# EAGLE design encoder_resolver (EAGLE 6.5.0)

## Sheet 1 of 8
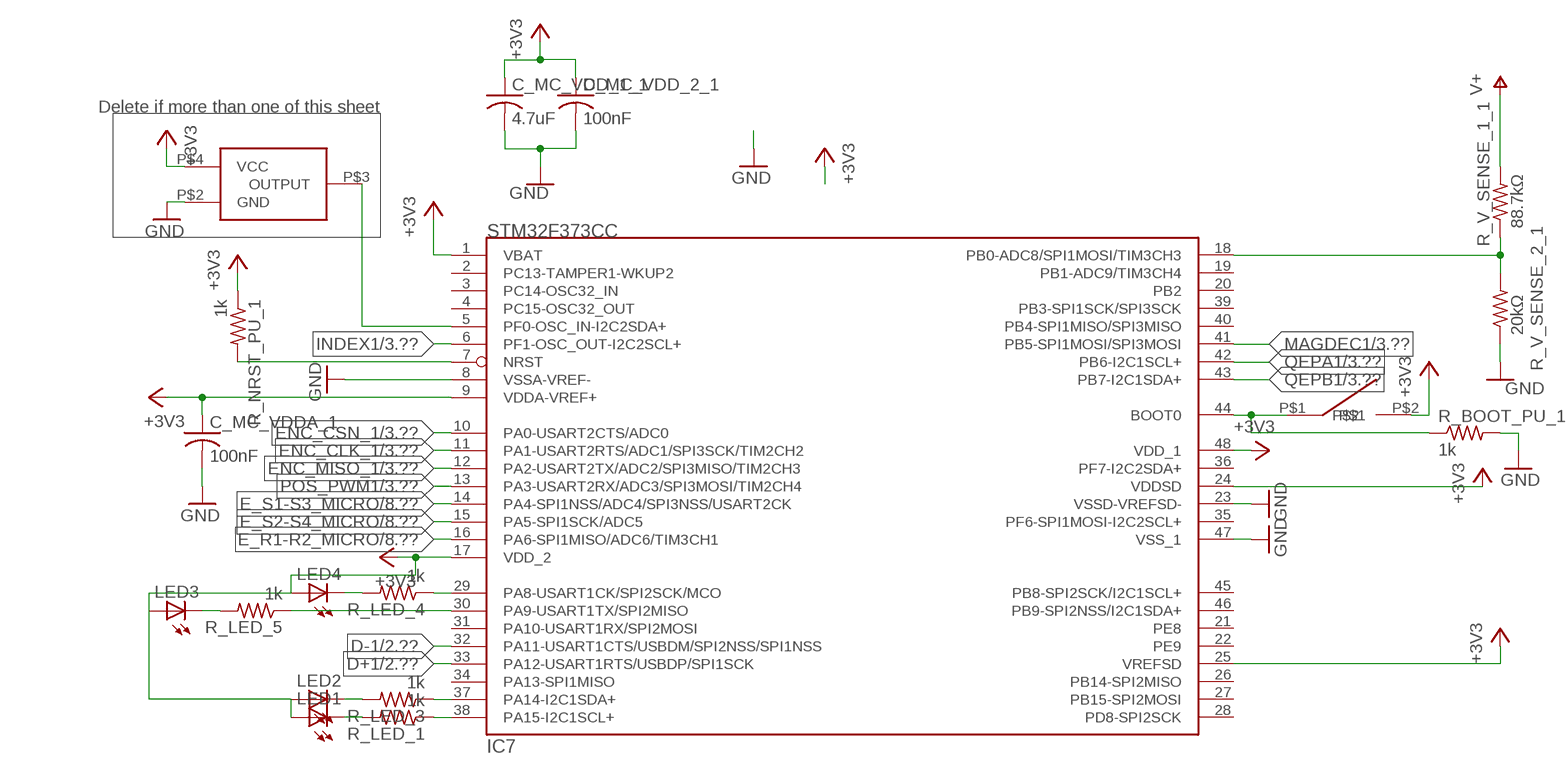
[diagram p0: schematic, sheet 1]

### Parts
C_MC_VDD_1_1  4.7uF  C-USC0603  [C0603]
C_MC_VDD_2_1  100nF  C-USC0603  [C0603]
C_MC_VDDA_1  100nF  C-USC0603  [C0603]
IC7  STM32F373CC  [LQFP48]
LED1  LEDCHIPLED_0603  [CHIPLED_0603]
LED2  LEDCHIPLED_0603  [CHIPLED_0603]
LED3  LEDCHIPLED_0603  [CHIPLED_0603]
LED4  LEDCHIPLED_0603  [CHIPLED_0603]
OSC1  FOX924B  [4-SMD_5X3.2]
R_BOOT_PU_1  1k  R-US_R0603  [R0603]
R_LED_1  1k  R-US_R0603  [R0603]
R_LED_3  1k  R-US_R0603  [R0603]
R_LED_4  1k  R-US_R0603  [R0603]
R_LED_5  1k  R-US_R0603  [R0603]
R_NRST_PU_1  1k  R-US_R0603  [R0603]
R_V_SENSE_1_1  88.7kΩ  R-US_R0603  [R0603]
R_V_SENSE_2_1  20kΩ  R-US_R0603  [R0603]
SW1  B3U  [B3U]

### Nets
16MHZ_3V3: IC7.5(PF0-OSC_IN-I2C2SDA+) OSC1.P$3(OUTPUT)
+3V3: C_MC_VDD_1_1.1 C_MC_VDD_2_1.1 C_MC_VDDA_1.1 IC7.1(VBAT) IC7.9(VDDA-VREF+) IC7.17(VDD_2) IC7.24(VDDSD) IC7.25(VREFSD) IC7.48(VDD_1) LED1.A LED2.A LED3.A LED4.A OSC1.P$4(VCC) R_NRST_PU_1.1 SW1.P$2 ; also sheet 3,5,8
BOOT0_1: IC7.44(BOOT0) R_BOOT_PU_1.1 SW1.P$1
D+1: IC7.33(PA12-USART1RTS/USBDP/SPI1SCK) ; also sheet 2
D-1: IC7.32(PA11-USART1CTS/USBDM/SPI2NSS/SPI1NSS) ; also sheet 2
E_R1-R2_MICRO: IC7.16(PA6-SPI1MISO/ADC6/TIM3CH1) ; also sheet 8
E_S1-S3_MICRO: IC7.14(PA4-SPI1NSS/ADC4/SPI3NSS/USART2CK) ; also sheet 8
E_S2-S4_MICRO: IC7.15(PA5-SPI1SCK/ADC5) ; also sheet 8
ENC_CLK_1: IC7.11(PA1-USART2RTS/ADC1/SPI3SCK/TIM2CH2) ; also sheet 3
ENC_CSN_1: IC7.10(PA0-USART2CTS/ADC0) ; also sheet 3
ENC_MISO_1: IC7.12(PA2-USART2TX/ADC2/SPI3MISO/TIM2CH3) ; also sheet 3
GND: C_MC_VDD_1_1.2 C_MC_VDD_2_1.2 C_MC_VDDA_1.2 IC7.8(VSSA-VREF-) IC7.23(VSSD-VREFSD-) IC7.47(VSS_1) OSC1.P$2(GND) R_BOOT_PU_1.2 R_V_SENSE_2_1.1 ; also sheet 2,3,4,5,6,7,8
INDEX1: IC7.6(PF1-OSC_OUT-I2C2SCL+) ; also sheet 3
MAGDEC1: IC7.41(PB5-SPI1MOSI/SPI3MOSI) ; also sheet 3
N$1: LED1.C R_LED_1.2
N$3: IC7.18(PB0-ADC8/SPI1MOSI/TIM3CH3) R_V_SENSE_1_1.1 R_V_SENSE_2_1.2
N$5: IC7.38(PA15-I2C1SCL+) R_LED_1.1
N$6: LED2.C R_LED_3.2
N$8: IC7.37(PA14-I2C1SDA+) R_LED_3.1
N$10: LED4.C R_LED_4.2
N$11: LED3.C R_LED_5.2
N$12: IC7.29(PA8-USART1CK/SPI2SCK/MCO) R_LED_4.1
N$13: IC7.30(PA9-USART1TX/SPI2MISO) R_LED_5.1
NRST_1: IC7.7(NRST) R_NRST_PU_1.2
POS_PWM1: IC7.13(PA3-USART2RX/ADC3/SPI3MOSI/TIM2CH4) ; also sheet 3
QEPA1: IC7.42(PB6-I2C1SCL+) ; also sheet 3
QEPB1: IC7.43(PB7-I2C1SDA+) ; also sheet 3
V+: R_V_SENSE_1_1.2 ; also sheet 4,7,8
Unconnected: IC7.2(PC13-TAMPER1-WKUP2) IC7.3(PC14-OSC32_IN) IC7.4(PC15-OSC32_OUT) IC7.19(PB1-ADC9/TIM3CH4) IC7.20(PB2) IC7.21(PE8) IC7.22(PE9) IC7.26(PB14-SPI2MISO) IC7.27(PB15-SPI2MOSI) IC7.28(PD8-SPI2SCK) IC7.31(PA10-USART1RX/SPI2MOSI) IC7.34(PA13-SPI1MISO) IC7.35(PF6-SPI1MOSI-I2C2SCL+) IC7.36(PF7-I2C2SDA+) IC7.39(PB3-SPI1SCK/SPI3SCK) IC7.40(PB4-SPI1MISO/SPI3MISO) IC7.45(PB8-SPI2SCK/I2C1SCL+) IC7.46(PB9-SPI2NSS/I2C1SDA+)

### Notes on the sheet
- Delete if more than one of this sheet

## Sheet 2 of 8
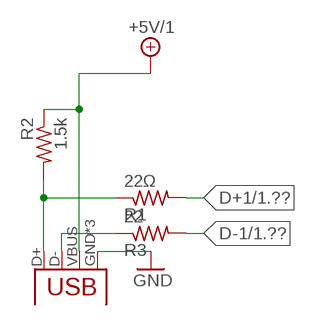
[diagram p1: schematic, sheet 2]

### Parts
R1  22Ω  R-US_R0603  [R0603]
R2  1.5k  R-US_R0603  [R0603]
R3  22  R-US_R0603  [R0603]
X1  USB-MICROB  [USB-MICROB]

### Nets
+5V/1: R2.1 X1.VBUS ; also sheet 6
D+1: R1.2 ; also sheet 1
D+_IN_1: R1.1 R2.2 X1.D+
D-1: R3.2 ; also sheet 1
D-_IN_1: R3.1 X1.D-
GND: X1.GND X1.MT1(GND) X1.MT2(GND) ; also sheet 1,3,4,5,6,7,8

## Sheet 3 of 8
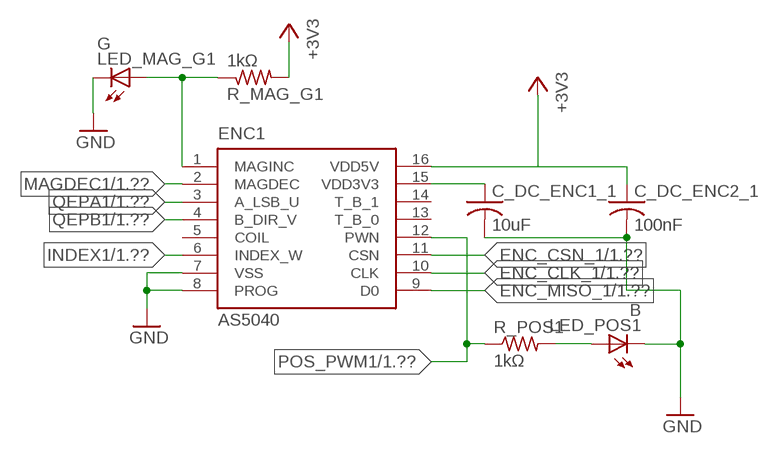
[diagram p2: schematic, sheet 3]

### Parts
C_DC_ENC1_1  10uF  C-USC0603  [C0603]
C_DC_ENC2_1  100nF  C-USC0603  [C0603]
ENC1  AS5040  [SSOP16]
LED_MAG_G1  G  LEDCHIP-LED0603  [CHIP-LED0603]
LED_POS1  B  LEDCHIP-LED0603  [CHIP-LED0603]
R_MAG_G1  1kΩ  R-US_R0603  [R0603]
R_POS1  1kΩ  R-US_R0603  [R0603]

### Nets
+3V3: C_DC_ENC2_1.1 ENC1.16(VDD5V) R_MAG_G1.2 ; also sheet 1,5,8
ENC_3V3_1: C_DC_ENC1_1.1 ENC1.15(VDD3V3)
ENC_CLK_1: ENC1.10(CLK) ; also sheet 1
ENC_CSN_1: ENC1.11(CSN) ; also sheet 1
ENC_MISO_1: ENC1.9(D0) ; also sheet 1
GND: C_DC_ENC1_1.2 C_DC_ENC2_1.2 ENC1.7(VSS) ENC1.8(PROG) LED_MAG_G1.C LED_POS1.C ; also sheet 1,2,4,5,6,7,8
INDEX1: ENC1.6(INDEX_W) ; also sheet 1
MAGDEC1: ENC1.2(MAGDEC) ; also sheet 1
MAGINC1: ENC1.1(MAGINC) LED_MAG_G1.A R_MAG_G1.1
N$15: LED_POS1.A R_POS1.2
POS_PWM1: ENC1.12(PWN) R_POS1.1 ; also sheet 1
QEPA1: ENC1.3(A_LSB_U) ; also sheet 1
QEPB1: ENC1.4(B_DIR_V) ; also sheet 1
Unconnected: ENC1.5(COIL) ENC1.13(T_B_0) ENC1.14(T_B_1)

## Sheet 4 of 8
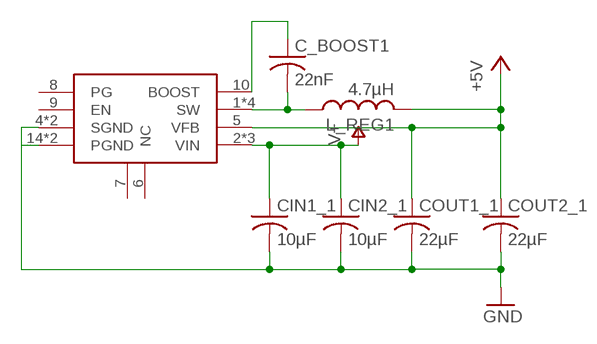
[diagram p3: schematic, sheet 4]

### Parts
C_BOOST1  22nF  C-USC0603  [C0603]
CIN1_1  10µF  C-USC0805  [C0805]
CIN2_1  10µF  C-USC0805  [C0805]
COUT1_1  22µF  C-USC0603  [C0603]
COUT2_1  22µF  C-USC0603  [C0603]
L_REG1  4.7µH  VLC5045  [VLC5045]
SW_REG1  MCP16323  [QFN16]

### Nets
+5V: COUT1_1.1 COUT2_1.1 L_REG1.2 SW_REG1.5(VFB) ; also sheet 5,6
BOOST1: C_BOOST1.1 SW_REG1.10(BOOST)
GND: CIN1_1.2 CIN2_1.2 COUT1_1.2 COUT2_1.2 SW_REG1.4(SGND) SW_REG1.14(PGND) SW_REG1.15(PGND) SW_REG1.TH(SGND) ; also sheet 1,2,3,5,6,7,8
SW1: C_BOOST1.2 L_REG1.1 SW_REG1.1(SW) SW_REG1.12(SW) SW_REG1.13(SW) SW_REG1.16(SW)
V+: CIN1_1.1 CIN2_1.1 SW_REG1.2(VIN) SW_REG1.3(VIN) SW_REG1.11(VIN) ; also sheet 1,7,8
Unconnected: SW_REG1.6(NC) SW_REG1.7(NC2) SW_REG1.8(PG) SW_REG1.9(EN)

## Sheet 5 of 8
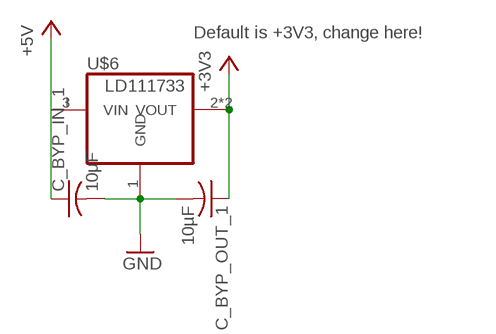
[diagram p4: schematic, sheet 5]

### Parts
C_BYP_IN_1  10µF  C-USC1206  [C1206]
C_BYP_OUT_1  10µF  C-USC0603  [C0603]
U$6  LD111733  REG_SOT223LD1117XX  [SOT-223]

### Nets
+3V3: C_BYP_OUT_1.1 U$6.2(VOUT) U$6.4(VOUT) ; also sheet 1,3,8
+5V: C_BYP_IN_1.1 U$6.3(VIN) ; also sheet 4,6
GND: C_BYP_IN_1.2 C_BYP_OUT_1.2 U$6.1(GND) ; also sheet 1,2,3,4,6,7,8

### Notes on the sheet
- Default is +3V3, change here!

## Sheet 6 of 8
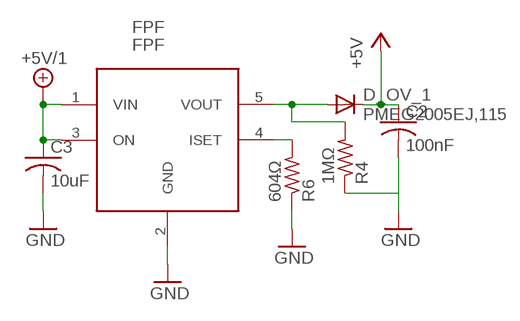
[diagram p5: schematic, sheet 6]

### Parts
C2  100nF  C-USC0603  [C0603]
C3  10uF  C-USC0603  [C0603]
D_OV_1  PMEG2005EJ,115  DIODE-SOD323-W  [SOD323-W]
FPF  FPF  FPF2123  [SOT23-5L]
R4  1MΩ  R-US_R0603  [R0603]
R6  604Ω  R-US_R0603  [R0603]

### Nets
+5V: C2.1 D_OV_1.C ; also sheet 4,5
+5V/1: C3.1 FPF.1(VIN) FPF.3(ON) ; also sheet 2
GND: C2.2 C3.2 FPF.2(GND) R4.1 R6.1 ; also sheet 1,2,3,4,5,7,8
LOAD_ISET_1: FPF.4(ISET) R6.2
N$17: D_OV_1.A FPF.5(VOUT) R4.2

## Sheet 7 of 8
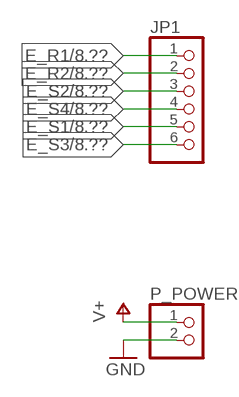
[diagram p6: schematic, sheet 7]

### Parts
JP1  PINHD-1X6  [1X06]
P_POWER  PINHD-1X2  [1X02]

### Nets
E_R1: JP1.1 ; also sheet 8
E_R2: JP1.2 ; also sheet 8
E_S1: JP1.5 ; also sheet 8
E_S2: JP1.3 ; also sheet 8
E_S3: JP1.6 ; also sheet 8
E_S4: JP1.4 ; also sheet 8
GND: P_POWER.2 ; also sheet 1,2,3,4,5,6,8
V+: P_POWER.1 ; also sheet 1,4,8

## Sheet 8 of 8
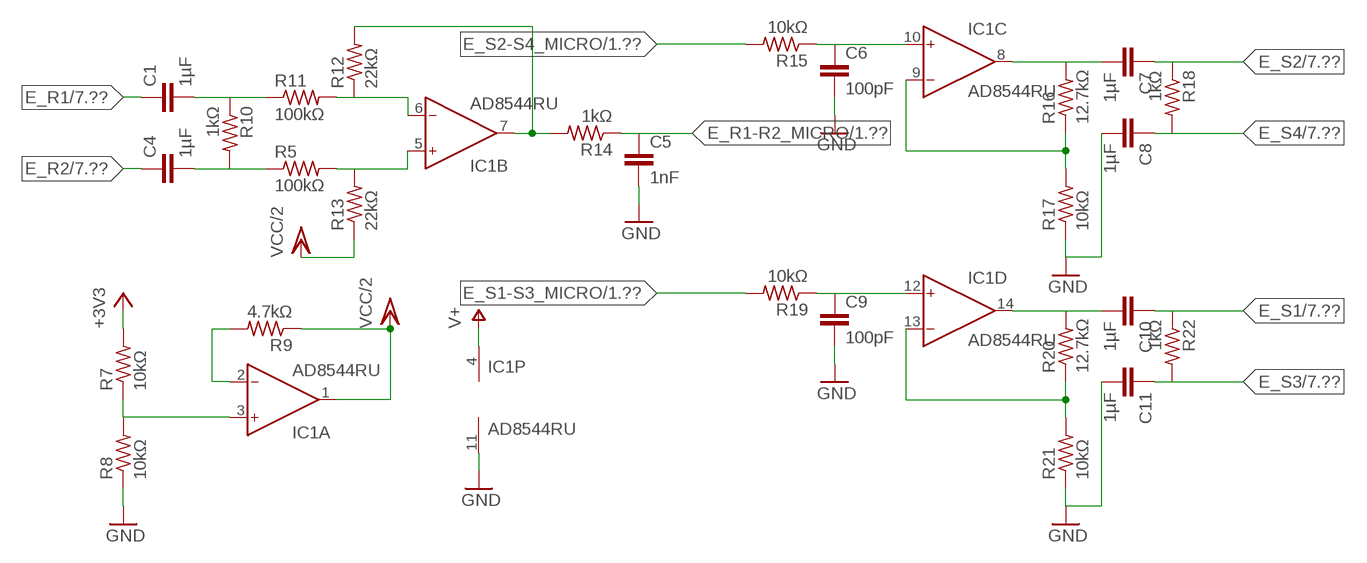
[diagram p7: schematic, sheet 8]

### Parts
C1  1µF  C-EUC0603  [C0603]
C4  1µF  C-EUC0603  [C0603]
C5  1nF  C-EUC0603  [C0603]
C6  100pF  C-EUC0603  [C0603]
C7  1µF  C-EUC0603  [C0603]
C8  1µF  C-EUC0603  [C0603]
C9  100pF  C-EUC0603  [C0603]
C10  1µF  C-EUC0603  [C0603]
C11  1µF  C-EUC0603  [C0603]
IC1  AD8544RU  [TSSOP14]
R5  100kΩ  R-US_R0603  [R0603]
R7  10kΩ  R-US_R0603  [R0603]
R8  10kΩ  R-US_R0603  [R0603]
R9  4.7kΩ  R-US_R0603  [R0603]
R10  1kΩ  R-US_R0603  [R0603]
R11  100kΩ  R-US_R0603  [R0603]
R12  22kΩ  R-US_R0603  [R0603]
R13  22kΩ  R-US_R0603  [R0603]
R14  1kΩ  R-US_R0603  [R0603]
R15  10kΩ  R-US_R0603  [R0603]
R16  12.7kΩ  R-US_R0603  [R0603]
R17  10kΩ  R-US_R0603  [R0603]
R18  1kΩ  R-US_R0603  [R0603]
R19  10kΩ  R-US_R0603  [R0603]
R20  12.7kΩ  R-US_R0603  [R0603]
R21  10kΩ  R-US_R0603  [R0603]
R22  1kΩ  R-US_R0603  [R0603]

### Nets
+3V3: R7.2 ; also sheet 1,3,5
E_R1: C1.1 ; also sheet 7
E_R1-R2_MICRO: C5.1 R14.1 ; also sheet 1
E_R2: C4.1 ; also sheet 7
E_S1: C10.1 R22.1 ; also sheet 7
E_S1-S3_MICRO: R19.2 ; also sheet 1
E_S2: C7.1 R18.1 ; also sheet 7
E_S2-S4_MICRO: R15.2 ; also sheet 1
E_S3: C11.1 R22.2 ; also sheet 7
E_S4: C8.1 R18.2 ; also sheet 7
GND: C5.2 C6.2 C8.2 C9.2 C11.2 IC1.11(P:V-) R8.1 R17.1 R21.1 ; also sheet 1,2,3,4,5,6,7
N$2: IC1.3(A:IN+) R7.1 R8.2
N$9: IC1.2(A:IN-) R9.2
N$18: C4.2 R5.1 R10.2
N$19: C1.2 R10.1 R11.1
N$20: IC1.5(B:IN+) R5.2 R13.2
N$21: IC1.6(B:IN-) R11.2 R12.1
N$22: IC1.7(B:OUT) R12.2 R14.2
N$23: C6.1 IC1.10(C:IN+) R15.1
N$24: IC1.9(C:IN-) R16.1 R17.2
N$25: C7.2 IC1.8(C:OUT) R16.2
N$26: C9.1 IC1.12(D:IN+) R19.1
N$27: IC1.13(D:IN-) R20.1 R21.2
N$28: C10.2 IC1.14(D:OUT) R20.2
V+: IC1.4(P:V+) ; also sheet 1,4,7
VCC/2: IC1.1(A:OUT) R9.1 R13.1

## Library data of the parts
C1 C4-C11 = resistor:C-EU: CAPACITOR, European symbol
C2 C3 C_BOOST1 C_BYP_IN_1 C_BYP_OUT_1 C_DC_ENC1_1 C_DC_ENC2_1 C_MC_VDD_1_1 C_MC_VDD_2_1 C_MC_VDDA_1 CIN1_1 CIN2_1 COUT1_1 COUT2_1 = resistor:C-US: CAPACITOR, American symbol
D_OV_1 = diode:DIODE-: DIODE
ENC1 = austriamicrosystems:AS5040: 10-BIT PROGRAMMABLE MAGNETIC ROTARY ENCODER Source: www.austriamicrosystems.com .. AS5040DataSheetRev12.pdf; MPN: AS5040ASSU; OC_FARNELL: 1630800; OC_NEWARK: 59P4059
FPF = neels:FPF2123
IC1 = analog-devices:AD8544: General-Purpose CMOS Rail-to-Rail Amplifiers Source: http://www.analog.com/static/imported-files/data_sheets/AD8541_8542_8544.pdf; MPN: AD8544ARUZ; OC_FARNELL: unknown; OC_NEWARK: 15P1001
IC7 = neels:STM32F373CC
JP1 = pinhead:PINHD-1X6: PIN HEADER
L_REG1 = piccoli:VLC5045
LED1-LED4 LED_MAG_G1 LED_POS1 = led:LED: LED OSRAM: - CHIPLED LG R971, LG N971, LY N971, LG Q971, LY Q971, LO R971, LY R971 LH N974, LH R974 LS Q976, LO Q976, LY Q976 LO Q996 - Hyper CHIPLED LW Q18S LB Q993, LB Q99A, LB R99A - SideLED LS A670, LO A670, LY A670, LG A670, LP A670 LB A673, LV A673, LT A673, LW A673 LH A674 LY A675 LS A676, LA A676, LO A676, LY A676, LW A676 LS A679, LY A679, LG A679 - Hyper Micro SIDELED® LS Y876, LA Y876, LO Y876, LY Y876 LT Y87S - SmartLED LW L88C, LW L88S LB L89C, LB L89S, LG L890 LS L89K, LO L89K, LY L89K LS L896, LA L896, LO L896, LY L896 - TOPLED LS T670, LO T670, LY T670, LG T670, LP T670 LSG T670, LSP T670, LSY T670, LOP T670, LYG T670 LG T671, LOG T671, LSG T671 LB T673, LV T673, LT T673, LW T673 LH T674 LS T676, LA T676, LO T676, LY T676, LB T676, LH T676, LSB T676, LW T676 LB T67C, LV T67C, LT T67C, LS T67K, LO T67K, LY T67K, LW E67C LS E67B, LA E67B, LO E67B, LY E67B, LB E67C, LV E67C, LT E67C LW T67C LS T679, LY T679, LG T679 LS T770, LO T770, LY T770, LG T770, LP T770 LB T773, LV T773, LT T773, LW T773 LH T774 LS E675, LA E675, LY E675, LS T675 LS T776, LA T776, LO T776, LY T776, LB T776 LHGB T686 LT T68C, LB T68C - Hyper Mini TOPLED® LB M676 - Mini TOPLED Santana® LG M470 LS M47K, LO M47K, LY M47K Source: http://www.osram.convergy.de LUXEON: - LUMILED® LXK2-PW12-R00, LXK2-PW12-S00, LXK2-PW14-U00, LXK2-PW14-V00 LXK2-PM12-R00, LXK2-PM12-S00, LXK2-PM14-U00 LXK2-PE12-Q00, LXK2-PE12-R00, LXK2-PE12-S00, LXK2-PE14-T00, LXK2-PE14-U00 LXK2-PB12-K00, LXK2-PB12-L00, LXK2-PB12-M00, LXK2-PB14-N00, LXK2-PB14-P00, LXK2-PB14-Q00 LXK2-PR12-L00, LXK2-PR12-M00, LXK2-PR14-Q00, LXK2-PR14-R00 LXK2-PD12-Q00, LXK2-PD12-R00, LXK2-PD12-S00 LXK2-PH12-R00, LXK2-PH12-S00 LXK2-PL12-P00, LXK2-PL12-Q00, LXK2-PL12-R00 Source: www.luxeon.com KINGBRIGHT: KA-3528ASYC Source: www.kingbright.com
OSC1 = piccoli:FOX924B
P_POWER = pinhead:PINHD-1X2: PIN HEADER
R1-R22 R_BOOT_PU_1 R_LED_1 R_LED_3-R_LED_5 R_MAG_G1 R_NRST_PU_1 R_POS1 R_V_SENSE_1_1 R_V_SENSE_2_1 = resistor:R-US_: RESISTOR, American symbol
SW1 = zz-upenn:B3U
SW_REG1 = piccoli:MCP16323
U$6 = piccoli:REG_SOT223
X1 = SparkFun:USB: USB Connectors USB-B-PTH is fully proven SKU : PRT-00139 USB-miniB is fully proven SKU : PRT-00587 USB-A-PCB is untested. USB-A-H is throughly reviewed, but untested. Spark Fun Electronics SKU : PRT-00437 USB-B-SMT is throughly reviewed, but untested. Needs silkscreen touching up. USB-A-S has not been used/tested USB-MB-H has not been used/tested

## Board
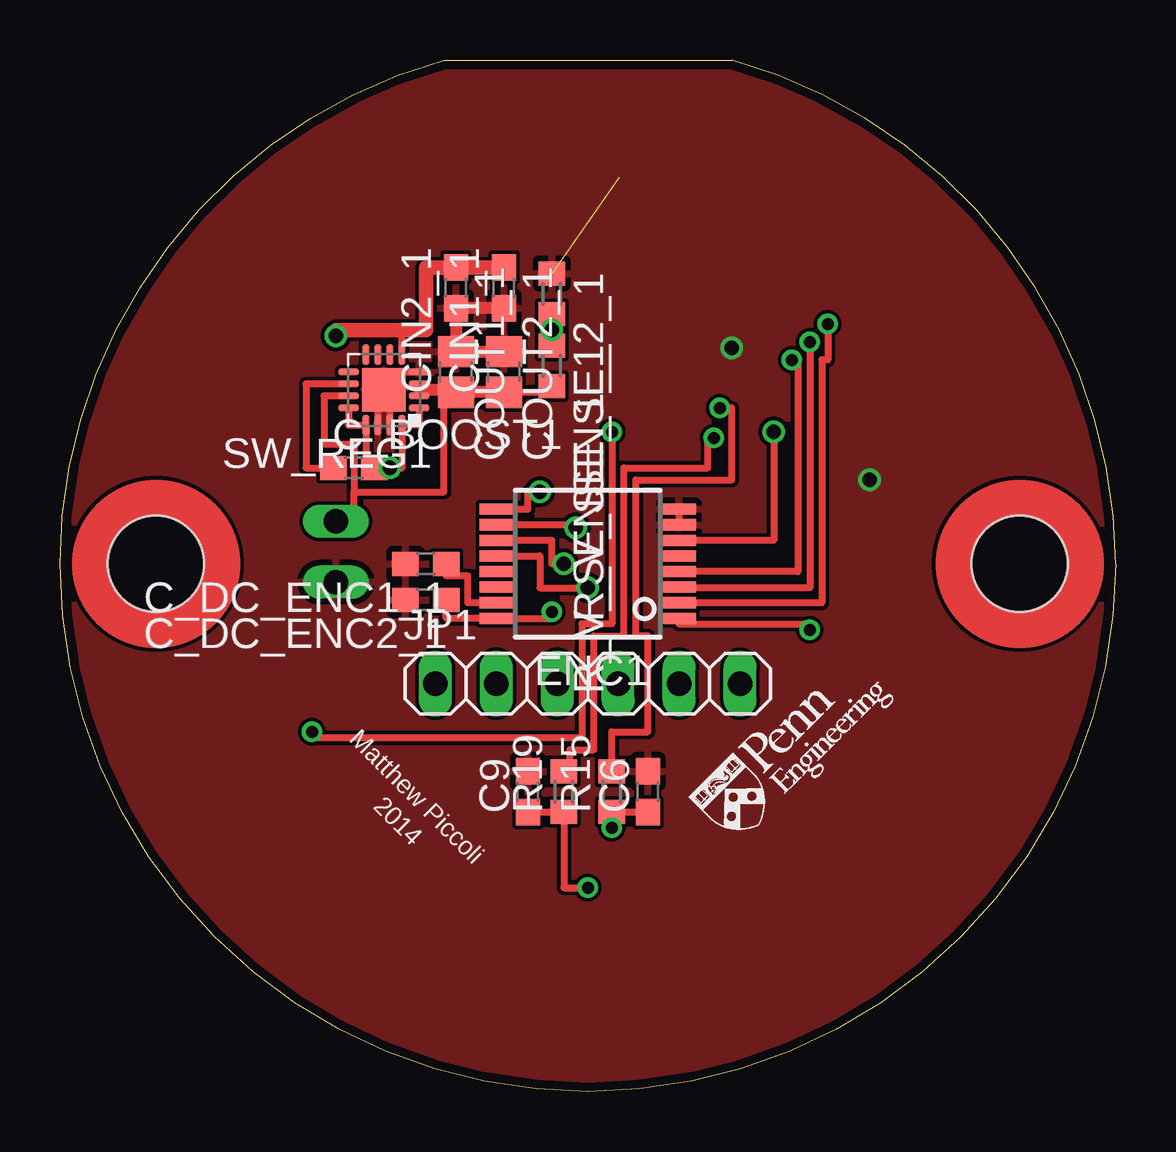
[diagram p8: board, top side]
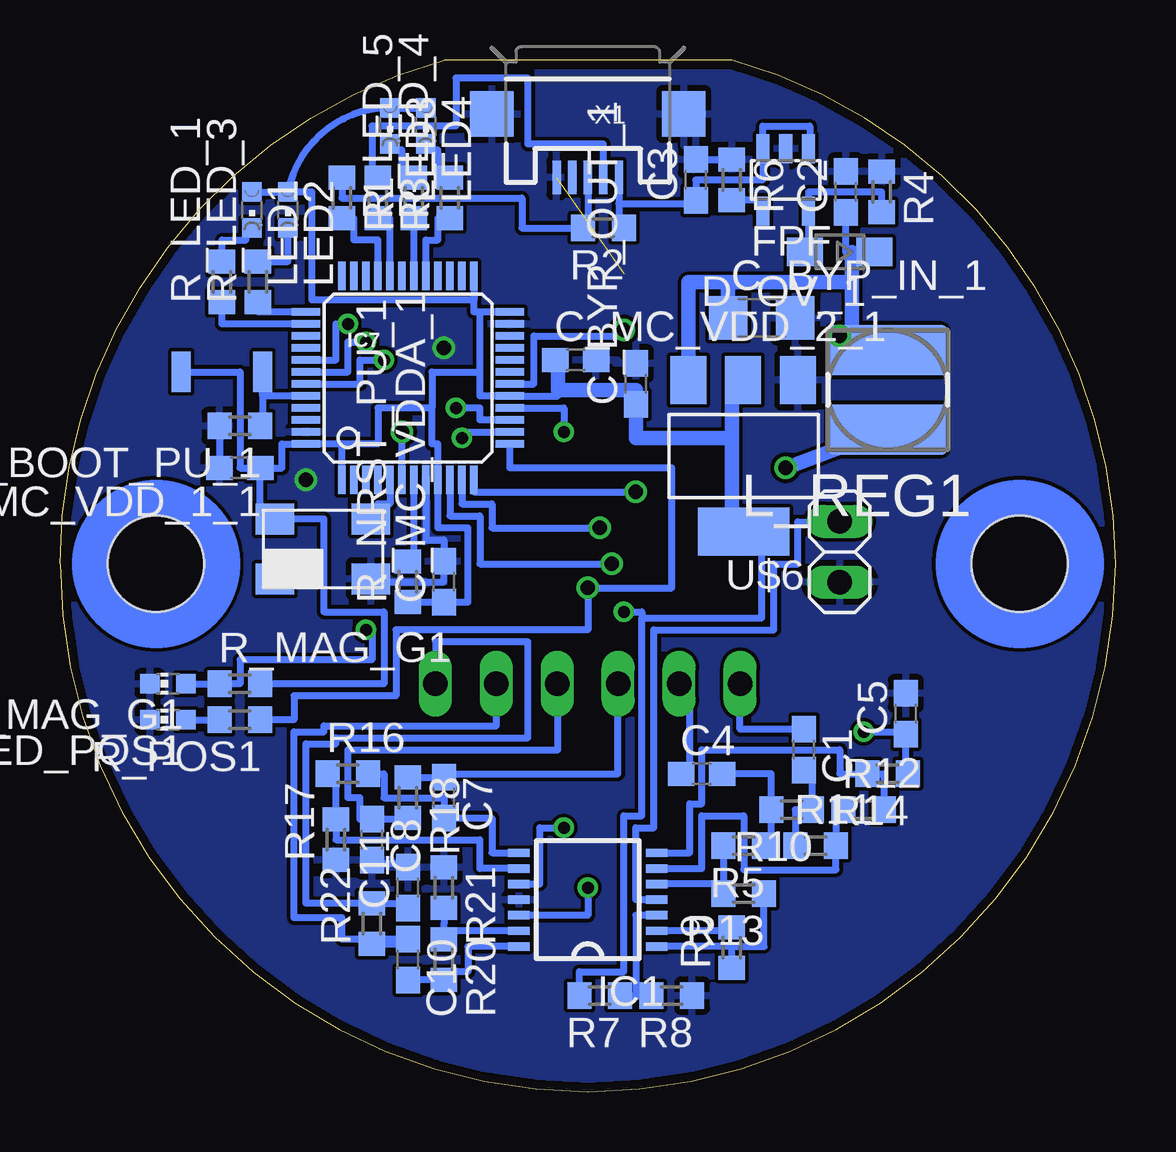
[diagram p9: board, bottom side, seen from below]

Size 44 x 43 mm. Coordinates in mm from the lower left corner, seen from the top.
Outline: 44,22 arc-180 0,22
Outline: 44,22 arc-180 0,22
Outline: 0,22 arc-74 16,43 28,43 arc-74 44,22
Copper layers (1*16): Top 0.0356mm / dielectric 1.5011mm / Bottom 0.0356mm
Design rules "LaenPCBOrder *": minimum track width 6mil, minimum drill 13mil, track to track 6mil, track to pad 6mil, pad to pad 6mil, via to via 6mil, smd to smd 6mil, copper to edge 15mil, drill to drill 6mil, minimum pad ring 7mil, minimum via ring 7mil, stop-mask expansion 4mil, vias tented up to drill 0mil, thermal gap 10mil
Holes 4 mm at 4,22 40,22

### Footprints (pad centres in the part's own frame; a part is rotated, then mirrored left to right if it is on the bottom)
C0603 = smd 1.1 x 1: 1 -0.85,0; 2 0.85,0
C1206 = smd 1.6 x 1.8: 1 -1.4,0; 2 1.4,0
C0805 = smd 1.3 x 1.5: 1 -0.85,0; 2 0.85,0
SOD323-W = smd 1.5 x 1.2: A 1.45,0; C -1.45,0
SSOP16 = smd 0.46 x 1.43: 1 -2.275,-3.795; 2 -1.625,-3.795; 3 -0.975,-3.795; 4 -0.325,-3.795; 5 0.325,-3.795; 6 0.975,-3.795; 7 1.625,-3.795; 8 2.275,-3.795; 9 2.275,3.795; 10 1.625,3.795; 11 0.975,3.795; 12 0.325,3.795; 13 -0.325,3.795; 14 -0.975,3.795; 15 -1.625,3.795; 16 -2.275,3.795
SOT23-5L = smd 0.55 x 1.2: 1 -0.95,-1.3; 2 0,-1.3; 3 0.95,-1.3; 4 0.95,1.3; 5 -0.95,1.3
TSSOP14 = smd 0.9 x 0.35: 1 -2.875,1.95; 2 -2.875,1.3; 3 -2.875,0.65; 4 -2.875,0; 5 -2.875,-0.65; 6 -2.875,-1.3; 7 -2.875,-1.95; 8 2.875,-1.95; 9 2.875,-1.3; 10 2.875,-0.65; 11 2.875,0; 12 2.875,0.65; 13 2.875,1.3; 14 2.875,1.95
LQFP48 = smd 0.3 x 1.2: 1 -2.75,-4.25; 2 -2.25,-4.25; 3 -1.75,-4.25; 4 -1.25,-4.25; 5 -0.75,-4.25; 6 -0.25,-4.25; 7 0.25,-4.25; 8 0.75,-4.25; 9 1.25,-4.25; 10 1.75,-4.25; 11 2.25,-4.25; 12 2.75,-4.25; 25 2.75,4.25; 26 2.25,4.25; 27 1.75,4.25; 28 1.25,4.25; 29 0.75,4.25; 30 0.25,4.25; 31 -0.25,4.25; 32 -0.75,4.25; 33 -1.25,4.25; 34 -1.75,4.25; 35 -2.25,4.25; 36 -2.75,4.25 | smd 1.2 x 0.3: 13 4.25,-2.75; 14 4.25,-2.25; 15 4.25,-1.75; 16 4.25,-1.25; 17 4.25,-0.75; 18 4.25,-0.25; 19 4.25,0.25; 20 4.25,0.75; 21 4.25,1.25; 22 4.25,1.75; 23 4.25,2.25; 24 4.25,2.75; 37 -4.25,2.75; 38 -4.25,2.25; 39 -4.25,1.75; 40 -4.25,1.25; 41 -4.25,0.75; 42 -4.25,0.25; 43 -4.25,-0.25; 44 -4.25,-0.75; 45 -4.25,-1.25; 46 -4.25,-1.75; 47 -4.25,-2.25; 48 -4.25,-2.75
1X06 = drill 1.016 long: 1 -6.35,0; 2 -3.81,0; 3 -1.27,0; 4 1.27,0; 5 3.81,0; 6 6.35,0
VLC5045 = smd 5 x 2.1: 1 0,1.65; 2 0,-1.65
CHIPLED_0603 = smd 0.8 x 0.8: A 0,-0.75; C 0,0.75
CHIP-LED0603 = smd 0.8 x 0.8: A 0,-0.75; C 0,0.75
4-SMD_5X3.2 = smd 1.6 x 1.3: P$1 -2,-1.25; P$2 2,-1.25; P$3 2,1.25; P$4 -2,1.25
1X02 = drill 1.016 long: 1 -1.27,0; 2 1.27,0
R0603 = smd 1 x 1.1: 1 -0.85,0; 2 0.85,0
B3U = smd 0.8 x 1.7: P$1 -1.7,0; P$2 1.7,0
QFN16 = smd 0.85 x 0.3: 1 -1.475,0.75; 2 -1.475,0.25; 3 -1.475,-0.25; 4 -1.475,-0.75; 9 1.475,-0.75; 10 1.475,-0.25; 11 1.475,0.25; 12 1.475,0.75 | smd 0.3 x 0.85: 5 -0.75,-1.475; 6 -0.25,-1.475; 7 0.25,-1.475; 8 0.75,-1.475; 13 0.75,1.475; 14 0.25,1.475; 15 -0.25,1.475; 16 -0.75,1.475 | smd 1.8 x 1.8: TH 0,0
SOT-223 = smd 1.499 x 2.007: 1 -2.261,-3.15; 2 0.025,-3.15; 3 2.311,-3.15 | smd 3.81 x 2.007: 4 0,3.15
USB-MICROB = smd 0.35 x 1.4: D+ 0,2.65; D- -0.65,2.65; GND 1.3,2.65; ID 0.65,2.65; VBUS -1.3,2.65 | smd 1.8 x 1.9: MT1 -4,0; MT2 4,0

### Placement (x,y rotation side)
C1  13,14.25 270 bottom
C2  11.25,37.5 90 bottom
C3  17.5,38 90 bottom
C4  17.25,13.25 0 bottom
C5  8.75,15.75 90 bottom
C6  24.5,12.5 90 top
C7  28,12.25 270 bottom
C8  31,10.5 270 bottom
C9  19.5,12.5 90 top
C10  29.5,5.5 270 bottom
C11  29.5,8.5 90 bottom
C_BOOST1  12.25,26 0 top
C_BYP_IN_1  14.75,32.25 0 bottom
C_BYP_OUT_1  20,29.5 90 bottom
C_DC_ENC1_1  15.25,22 180 top
C_DC_ENC2_1  15.25,20.5 180 top
C_MC_VDD_1_1  36.5,26 180 bottom
C_MC_VDD_2_1  22.5,30.5 0 bottom
C_MC_VDDA_1  28,21.25 90 bottom
CIN1_1  18.5,30 90 top
CIN2_1  16.5,30 90 top
COUT1_1  16.5,33.5 270 top
COUT2_1  18.5,33.5 270 top
D_OV_1  11.5,35 180 bottom
ENC1  22,22 90 top
FPF  13.75,38 180 bottom
IC1  22,8 180 bottom
IC7  29.5,29.75 0 bottom
JP1  22,17 0 top
L_REG1  9.5,29.25 180 bottom
LED1  36,36.75 180 bottom
LED2  34.5,36.75 180 bottom
LED3  30.25,40.25 180 bottom
LED4  28.75,40.25 180 bottom
LED_MAG_G1  39.5,17 90 bottom
LED_POS1  39.5,15.5 90 bottom
OSC1  33.04,22.62 0 bottom
P_POWER  11.5,22.5 270 bottom
R1  32.25,37.25 270 bottom
R2  21.35,36 180 bottom
R3  30.75,37.25 270 bottom
R4  9.75,37.5 270 bottom
R5  15.5,10.25 180 bottom
R6  16,38 270 bottom
R7  21.5,4 180 bottom
R8  18.5,4 180 bottom
R9  16,6 90 bottom
R10  13.5,11.75 180 bottom
R11  12.5,10.25 0 bottom
R12  10.5,11.75 0 bottom
R13  15.5,8.25 180 bottom
R14  9.5,13.25 180 bottom
R15  23,12.5 90 top
R16  32,13.25 0 bottom
R17  32.5,10.5 90 bottom
R18  29.5,12.25 270 bottom
R19  21,12.5 90 top
R20  28,5.5 270 bottom
R21  28,8.5 270 bottom
R22  31,7 90 bottom
R_BOOT_PU_1  36.5,27.75 180 bottom
R_LED_1  37.25,33.75 90 bottom
R_LED_3  35.75,33.75 90 bottom
R_LED_4  27.75,37.25 90 bottom
R_LED_5  29.25,37.25 90 bottom
R_MAG_G1  36.5,17 0 bottom
R_NRST_PU_1  29.5,21.25 90 bottom
R_POS1  36.5,15.5 180 bottom
R_V_SENSE_1_1  20.5,30.25 270 top
R_V_SENSE_2_1  20.5,33.25 270 top
SW1  37.25,30 180 bottom
SW_REG1  13.5,29.25 180 top
U$6  15.5,26.5 180 bottom
U$11  [PENN_ENGINEERING]  28.5,10 45 top
X1  22,40.75 180 bottom

### Tracks (layer width: path | path; a pad name or v marks a point on that pad's centre or on a via)
16MHZ_3V3
  Bottom 0.3: IC7.5 30.25,24.5 30.75,24.5 30.75,23.87 OSC1.P$3
+3V3  (via drill 0.5)
  Top 0.3: 16.1,20.73 C_DC_ENC2_1.1 16.1,19.73 ENC1.16 20.5,19.73 v20.5,20
  Bottom 0.3: LED4.A LED3.A arc-79 LED2.A | R_NRST_PU_1.1 C_MC_VDDA_1.1 27,20.4 27,23.5 28.25,23.5 IC7.9 28.25,27 28.5,27 28.5,28.5 | LED1.A LED2.A | IC7.25 26.75,33 | 26.75,33 33.5,33 33.5,37.5 LED2.A | IC7.24 26.5,32.5 | 26.5,32.5 26.75,32.5 26.75,33 | 26.5,30 26.5,29 IC7.17 23.25,29 23.25,29.25 | 26.5,30 26.5,32.5 | SW1.P$2 36.5,30 36.5,26 C_MC_VDD_1_1.1 | C_MC_VDD_1_1.1 35.65,23.87 OSC1.P$4 33,23.87 33,20 30.5,20 30.5,17 R_MAG_G1.2 | C_MC_VDD_1_1.1 34.75,26 34.75,27 IC7.48 32.25,27 | IC7.1 32.25,27 | 28.5,28.5 30.75,28.5 30.75,27 32.25,27 | 26.5,30 28.5,30 28.5,28.5 | C_BYP_OUT_1.1 20,27.25 | R7.2 22.35,5 20.5,5 20.5,11.5 19.75,11.5 19.75,19.75 | 19.75,19.75 14.75,19.75 14.75,23.35 U$6.4 | v20.5,20 19.75,20 19.75,19.75
  Bottom 0.6: U$6.2 16,29.65 16,27.25 | 16,27.25 16,23.35 U$6.4 | 16,27.25 20,27.25 20,29.25 23.25,29.25 23.25,30.5 C_MC_VDD_2_1.1
+5V  (via drill 0.6)
  Top 0.3: 16.65,34.35 COUT1_1.1 | SW_REG1.5 14.25,31.75
  Top 0.6: COUT2_1.1 COUT1_1.1 15.25,34.35 15.25,31.75 14.25,31.75 11.5,31.75 v11.5,31.5
  Bottom 0.3: L_REG1.2 11.5,30.75 v11.5,31.5 | D_OV_1.C 11,35 11.25,35 C2.1
  Bottom 0.4: L_REG1.2 11.25,30.9 11.25,31.75
  Bottom 0.6: 11,35 11,33.75 | 11,33.75 11,31.5 v11.5,31.5 | U$6.3 17.81,33.75 16.15,33.75 | 11,33.75 16,33.75 16.15,33.75 | C_BYP_IN_1.1 16.15,33.75
+5V/1
  Bottom 0.3: FPF.1 12.75,39.3 12.75,40.25 14.7,40.25 FPF.3 14.7,38 17.5,38 C3.1 17.5,37 20.7,37 | X1.VBUS 20.7,37 | 20.7,37 20.7,36 R2.1
BOOST1
  Top 0.3: SW_REG1.10 10.25,29.5 10.25,26 C_BOOST1.1
BOOT0_1
  Bottom 0.3: IC7.44 35.55,29 SW1.P$1 35.55,27.75 R_BOOT_PU_1.1
D+1
  Bottom 0.3: IC7.33 30.75,35.5 31.75,35.5 31.75,36.4 R1.2
D+_IN_1
  Bottom 0.3: X1.D+ 22,36 R2.2 24.75,36 24.75,37.25 32.25,37.25 R1.1
D-1
  Bottom 0.3: IC7.32 30.25,36.4 R3.2
D-_IN_1
  Bottom 0.3: X1.D- 21.35,39.5 24.5,39.5 24.5,42.25 27.5,42.25 27.5,40.25 31,40.25 31,38.1 R3.1
E_R1
  Bottom 0.3: C1.1 15.65,15.1 JP1.1
E_R1-R2_MICRO  (via drill 0.5)
  Top 0.3: v23,27.5 23,19.5 21.75,19.5 21.75,14.75 10.5,14.75 v10.5,15
  Bottom 0.3: R14.1 8.75,13.25 C5.1 8.75,15 v10.5,15 | IC7.16 23,28.5 v23,27.5
E_R2
  Bottom 0.3: C4.1 17.75,13.25 17.75,16.75 18.19,16.75 JP1.2
E_S1
  Bottom 0.3: R22.1 29.5,6.15 C10.1 32.25,6.35 32.25,7.25 34.25,7.25 34.25,15 33,15 33,15.25 25.81,15.25 JP1.5
E_S1-S3_MICRO  (via drill 0.5)
  Top 0.3: R19.2 21.25,13.35 21.25,14.25 22.25,14.25 22.25,19 23.5,19 23.5,26 27,26 27,27 27.25,27 v27.25,27.25
  Bottom 0.3: IC7.14 27.25,27.5 v27.25,27.25
E_S2
  Bottom 0.3: R18.1 C7.1 28,13.25 20.75,13.25 20.75,17 JP1.3
E_S2-S4_MICRO  (via drill 0.5)
  Top 0.3: R15.2 23,15 24.5,15 24.5,19 24,19 24,25.5 28,25.5 28,28.5 v27.5,28.5
  Bottom 0.3: IC7.15 26.5,28 26.5,28.5 v27.5,28.5
E_S3
  Bottom 0.3: C11.1 29.5,7.85 R22.2 33.75,7.85 33.75,14.5 32.5,14.5 32.5,14.75 24.5,14.75 24.5,18.75 28.35,18.75 JP1.6
E_S4
  Bottom 0.3: JP1.4 23.25,17 23.25,14.25 32,14.25 32,12.25 31.5,12.25 31.5,11.35 C8.1 29.5,11.35 R18.2
ENC_3V3_1
  Top 0.3: ENC1.15 17,20.38 17,21.5 16.1,21.5 C_DC_ENC1_1.1
ENC_CLK_1  (via drill 0.6)
  Top 0.3: v21.5,23.5 21.5,23.62 ENC1.10
  Bottom 0.3: IC7.11 27.25,24.5 26,24.5 26,23.5 v21.5,23.5
ENC_CSN_1  (via drill 0.6)
  Top 0.3: v21,22 20.5,22 20.5,22.98 ENC1.11
  Bottom 0.3: IC7.10 27.75,24 26.5,24 26.5,22 v21,22
ENC_MISO_1  (via drill 0.6)
  Top 0.3: ENC1.9 19.5,24.27 19.5,25 v20,25
  Bottom 0.3: IC7.12 26.75,25 v20,25
GND  (via drill 0.6)  (1 unrouted)
  Top 0.3: SW_REG1.15 13.75,29.25 SW_REG1.TH | SW_REG1.14 13.25,29.25 SW_REG1.TH | SW_REG1.4 13.5,30 SW_REG1.TH | ENC1.8 ENC1.7
  Top 0.5: COUT2_1.2 COUT1_1.2 CIN2_1.2 CIN1_1.2
  Bottom 0.3: C3.2 R6.1 | R_BOOT_PU_1.2 C_MC_VDD_1_1.2 | OSC1.P$2 31.04,21.25 28,21.25 C_MC_VDDA_1.2 28,23 28.75,23 IC7.8 | 29.5,9.5 31,9.5
  other vias: 28,31 33.75,25.5
  pour Bottom: 0,22 arc-90 22,44 arc-90 44,22 arc-90 22,0 arc-90
  pour Top: 0,22 arc-90 22,44 arc-90 44,22 arc-90 22,0 arc-90
INDEX1  (via drill 0.6)
  Top 0.3: v29.75,27.5 29.75,22.98 ENC1.6
  Bottom 0.3: IC7.6 v29.75,27.5
LOAD_ISET_1
  Bottom 0.3: 14.75,36.45 FPF.4 14.7,37.15 R6.2
MAGDEC1  (via drill 0.5)
  Top 0.3: v32,32 32,30.5 31.75,30.5 31.75,20.38 ENC1.2
  Bottom 0.3: IC7.41 32.5,30.5 32.5,32 v32,32
MAGINC1  (via drill 0.5)
  Top 0.3: ENC1.1 25.8,19.5 31.25,19.5 v31.25,19.25
  Bottom 0.3: LED_MAG_G1.A R_MAG_G1.1 36.5,17 36.5,18 31,18 31,19.25 v31.25,19.25
N$1
  Bottom 0.3: R_LED_1.2 37.25,35.5 36.25,35.5 36.25,36 LED1.C
N$2
  Bottom 0.3: R7.1 20,4 | 20,4 R8.2 | IC1.3 20,7.35 20,4
N$3  (via drill 0.6)
  Top 0.3: R_V_SENSE_1_1.1 v20.5,31.75 R_V_SENSE_2_1.2
  Bottom 0.3: IC7.18 24.25,29.5 24.25,31.5 20.5,31.5 v20.5,31.75
N$5
  Bottom 0.3: IC7.38 37.25,32 R_LED_1.1
N$6
  Bottom 0.3: R_LED_3.2 34.5,34.6 LED2.C
N$8
  Bottom 0.3: IC7.37 35.75,32.5 R_LED_3.1
N$9
  Bottom 0.3: R9.2 16,6.7 IC1.2
N$10
  Bottom 0.3: R_LED_4.2 28.25,38.1 28.25,39.25 28.75,39.25 LED4.C
N$11
  Bottom 0.3: R_LED_5.2 29.75,38.1 29.75,39.25 30.25,39.25 LED3.C
N$12
  Bottom 0.3: IC7.29 28.75,35.5 28.25,35.5 28.25,36.4 R_LED_4.1
N$13
  Bottom 0.3: IC7.30 R_LED_5.1
N$15
  Bottom 0.3: LED_POS1.A R_POS1.2
N$17
  Bottom 0.3: R4.2 9.75,37.5 12.8,37.5 FPF.5 12.8,35 D_OV_1.A
N$18
  Bottom 0.3: R5.1 14.35,10.25 R10.2 14.35,13.25 C4.2
N$19
  Bottom 0.3: C1.2 12.65,13.25 R10.1 13.35,11.75 R11.1
N$20
  Bottom 0.3: R5.2 R13.2 16.35,8.65 IC1.5
N$21
  Bottom 0.3: R12.1 11.65,11.75 R11.2 11.65,9.25 15.5,9.25 15.5,11.5 17.25,11.5 17.25,9.3 IC1.6
N$22
  Bottom 0.3: R12.2 9.65,13.25 R14.2 11.5,13.25 11.5,14.25 17.25,14.25 17.25,12 17.75,12 17.75,9.95 IC1.7
N$23  (via drill 0.5)
  Top 0.3: C6.1 R15.1 v23,11
  Bottom 0.3: IC1.10 24,8.65 24,11 v23,11
N$24
  Bottom 0.3: IC1.9 26.5,9.3 26.5,10.5 32.5,10.5 R17.2 32.5,13.25 R16.1
N$25
  Bottom 0.3: R16.2 30.5,13.25 30.5,12.25 28,12.25 C7.2 26,11.4 26,9.95 IC1.8
N$26  (via drill 0.5)
  Top 0.3: C9.1 R19.1 21,8.5 v22,8.5
  Bottom 0.3: v22,8.5 22,7.35 IC1.12
N$27
  Bottom 0.3: R21.2 28,7 28,6.7 | 28,6.7 R20.1 | IC1.13 28,6.7
N$28
  Bottom 0.3: C10.2 R20.2 28,5 27,5 27,6.05 IC1.14
NRST_1
  Bottom 0.3: R_NRST_PU_1.2 29.25,22.1 IC7.7
POS_PWM1  (via drill 0.6)
  Top 0.3: ENC1.12 20,22.32 20,21 v22,21
  Bottom 0.3: R_POS1.1 34.25,15.5 34.25,16.5 30,16.5 30,19.25 22,19.25 v22,21 18.5,21 18.5,26 25.25,26 IC7.13
QEPA1  (via drill 0.5)
  Top 0.3: v31.25,31.25 31.25,21 25.8,21 ENC1.3
  Bottom 0.3: IC7.42 32,30 32,31.25 v31.25,31.25
QEPB1  (via drill 0.5)
  Top 0.3: ENC1.4 30.75,21.68 30.75,30.5 v30.5,30.5
  Bottom 0.3: IC7.43 31.5,29.5 31.5,30.5 v30.5,30.5
SW1  (via drill 0.6)
  Top 0.3: SW_REG1.12 12.03,27.77 SW_REG1.13 12.75,26 C_BOOST1.2 v13.75,26 14.25,26 SW_REG1.16 14.97,27.77 SW_REG1.1
  Bottom 0.6: v13.75,26 L_REG1.1
V+
  Top 0.3: CIN2_1.1 16.5,29.25 | SW_REG1.3 SW_REG1.2 14.97,29.25 | 18.5,29.25 CIN1_1.1 | 18.5,28.9 CIN1_1.1 | SW_REG1.11 11,29 11,27 12.25,27 12.25,25 | 12.25,25 16,25 16,29.25 | 17.48,29.15 18,29.15 | CIN1_1.1 20.5,29.15 R_V_SENSE_1_1.2 | P_POWER.1 12.25,23.77 12.25,25
  Top 0.5: CIN1_1.1 18,29.15 CIN2_1.1 | 16.5,29.25 16,29.25 14.97,29.25
  Bottom 0.3: IC1.4 20,8 20,11 19.25,11 19.25,19.25 14.25,19.25 14.25,22 13.25,22 13.25,23.75 11.5,23.75 P_POWER.1
VCC/2
  Bottom 0.3: R9.1 16,6.05 | 16,6.05 IC1.1 | 16,6.05 14.65,6.05 R13.1
(copper drawn outside any net)
  shapes: Bottom circle x2, Top circle x2

### Text on the board
tPlace: Matthew Piccoli | 2014
tValues: AS5145B
bValues: W | G | A | R | FOX924B